# Altium schematic sheet Sheet.SchDoc
size A3
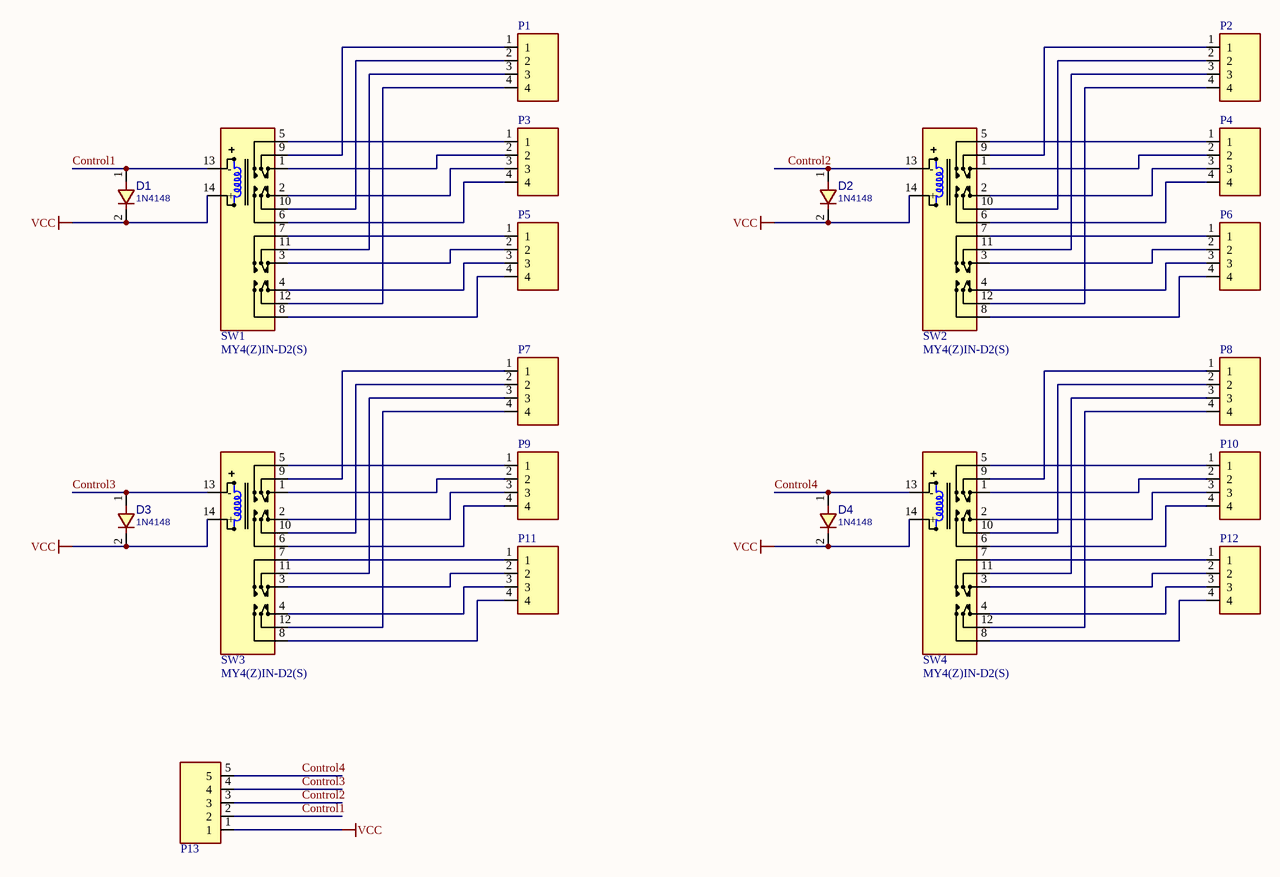
[diagram p0: Sheet.SchDoc]

## Parts
D1  1N4148  [D_SOD80]
D2  1N4148  [D_SOD80]
D3  1N4148  [D_SOD80]
D4  1N4148  [D_SOD80]
P1  CONN_PWL_4  [PWL_4]  (value not drawn)
P2  CONN_PWL_4  [PWL_4]  (value not drawn)
P3  CONN_PWL_4  [PWL_4]  (value not drawn)
P4  CONN_PWL_4  [PWL_4]  (value not drawn)
P5  CONN_PWL_4  [PWL_4]  (value not drawn)
P6  CONN_PWL_4  [PWL_4]  (value not drawn)
P7  CONN_PWL_4  [PWL_4]  (value not drawn)
P8  CONN_PWL_4  [PWL_4]  (value not drawn)
P9  CONN_PWL_4  [PWL_4]  (value not drawn)
P10  CONN_PWL_4  [PWL_4]  (value not drawn)
P11  CONN_PWL_4  [PWL_4]  (value not drawn)
P12  CONN_PWL_4  [PWL_4]  (value not drawn)
P13  CONN_PWL_5  [PWL_5]  (value not drawn)
SW1  MY4(Z)IN-D2(S)  [RY-HF18FF4]
SW2  MY4(Z)IN-D2(S)  [RY-HF18FF4]
SW3  MY4(Z)IN-D2(S)  [RY-HF18FF4]
SW4  MY4(Z)IN-D2(S)  [RY-HF18FF4]

## Nets
VCC: D1.2 D2.2 D3.2 D4.2 P13.1 SW1.14(+) SW2.14(+) SW3.14(+) SW4.14(+)
Control1: D1.1 P13.2 SW1.13(-)
Control2: D2.1 P13.3 SW2.13(-)
Control3: D3.1 P13.4 SW3.13(-)
Control4: D4.1 P13.5 SW4.13(-)
NetP1_1: P1.1 SW1.9(COM1)
NetP1_2: P1.2 SW1.10(COM2)
NetP1_3: P1.3 SW1.11(COM1)
NetP1_4: P1.4 SW1.12(COM2)
NetP2_1: P2.1 SW2.9(COM1)
NetP2_2: P2.2 SW2.10(COM2)
NetP2_3: P2.3 SW2.11(COM1)
NetP2_4: P2.4 SW2.12(COM2)
NetP3_1: P3.1 SW1.5(NO1)
NetP3_2: P3.2 SW1.1(NC1)
NetP3_3: P3.3 SW1.2(NC1)
NetP3_4: P3.4 SW1.6(NO2)
NetP4_1: P4.1 SW2.5(NO1)
NetP4_2: P4.2 SW2.1(NC1)
NetP4_3: P4.3 SW2.2(NC1)
NetP4_4: P4.4 SW2.6(NO2)
NetP5_1: P5.1 SW1.7(NO1)
NetP5_2: P5.2 SW1.3(NC1)
NetP5_3: P5.3 SW1.4(NC1)
NetP5_4: P5.4 SW1.8(NO2)
NetP6_1: P6.1 SW2.7(NO1)
NetP6_2: P6.2 SW2.3(NC1)
NetP6_3: P6.3 SW2.4(NC1)
NetP6_4: P6.4 SW2.8(NO2)
NetP7_1: P7.1 SW3.9(COM1)
NetP7_2: P7.2 SW3.10(COM2)
NetP7_3: P7.3 SW3.11(COM1)
NetP7_4: P7.4 SW3.12(COM2)
NetP8_1: P8.1 SW4.9(COM1)
NetP8_2: P8.2 SW4.10(COM2)
NetP8_3: P8.3 SW4.11(COM1)
NetP8_4: P8.4 SW4.12(COM2)
NetP9_1: P9.1 SW3.5(NO1)
NetP9_2: P9.2 SW3.1(NC1)
NetP9_3: P9.3 SW3.2(NC1)
NetP9_4: P9.4 SW3.6(NO2)
NetP10_1: P10.1 SW4.5(NO1)
NetP10_2: P10.2 SW4.1(NC1)
NetP10_3: P10.3 SW4.2(NC1)
NetP10_4: P10.4 SW4.6(NO2)
NetP11_1: P11.1 SW3.7(NO1)
NetP11_2: P11.2 SW3.3(NC1)
NetP11_3: P11.3 SW3.4(NC1)
NetP11_4: P11.4 SW3.8(NO2)
NetP12_1: P12.1 SW4.7(NO1)
NetP12_2: P12.2 SW4.3(NC1)
NetP12_3: P12.3 SW4.4(NC1)
NetP12_4: P12.4 SW4.8(NO2)

## Library data of the parts
D1-D4 = DIODE_SMD_1N4148: DIODE, FAST SWTICHING, 0.3A, 0.5W; DESC: DESCRIPTION; PARAM: 75V; PARAM2: 300mA, 0.5W; MANF: MANF; ASSEMBLY: ASSEMBLY; PRICE: PRICE; MANF_P#: 1N4148; VALUE: 1N4148
P1-P12 = CONN_PWL_4: Power Terminal 4pin,Header, 4-Pin; VALUE: CONN_PWL_4
P13 = CONN_PWL_5: Power Terminal 5pin,Header, 5-Pin; VALUE: CONN_PWL_5
SW1-SW4 = MY4NJ-24VDC: Omron 欧姆龙 功率继电器, MY4系列, 24V 直流线圈电压, 切换电流5A, 4 刀双掷, 插入 安装; MY4NJ-24VDC: MY4NJ-24VDC